# EAGLE schematic Clock2 (EAGLE 7.1.0)
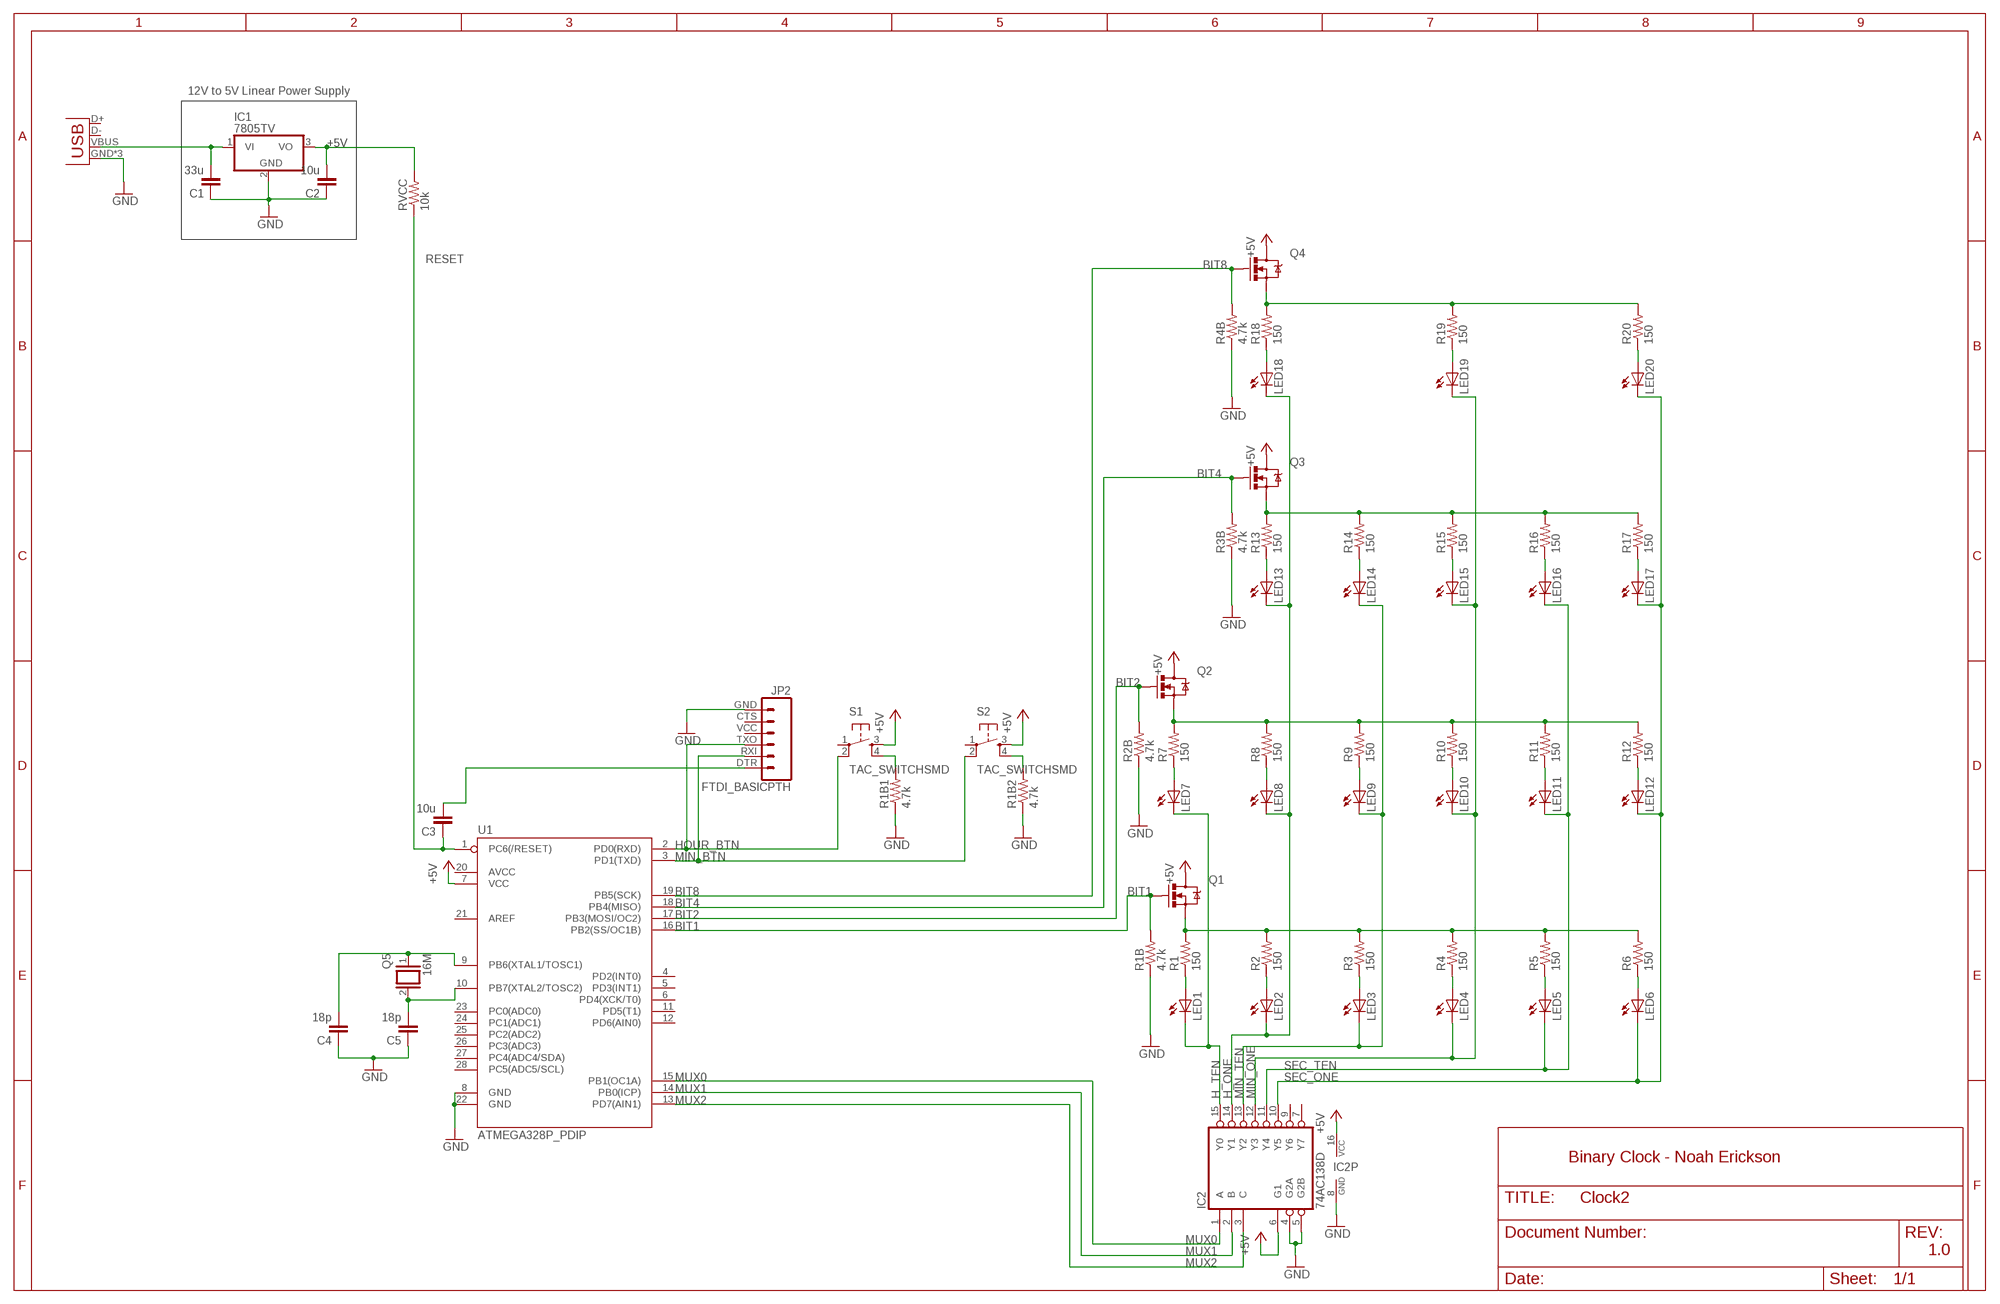
[diagram p0: schematic, sheet 1]

## Parts
C1  33u  C-EUC1206  [C1206]
C2  10u  C-EUC1206  [C1206]
C3  10u  C-EUC1206  [C1206]
C4  18p  C-EUC1206  [C1206]
C5  18p  C-EUC1206  [C1206]
IC1  7805TV  [TO220V]
IC2  74AC138D  [SO16]
JP1  USB-MICROB  [USB-MICROB]
JP2  FTDI_BASICPTH  [FTDI_BASIC]
LED1  LED3MM  [LED3MM]
LED2  LED3MM  [LED3MM]
LED3  LED3MM  [LED3MM]
LED4  LED3MM  [LED3MM]
LED5  LED3MM  [LED3MM]
LED6  LED3MM  [LED3MM]
LED7  LED3MM  [LED3MM]
LED8  LED3MM  [LED3MM]
LED9  LED3MM  [LED3MM]
LED10  LED3MM  [LED3MM]
LED11  LED3MM  [LED3MM]
LED12  LED3MM  [LED3MM]
LED13  LED3MM  [LED3MM]
LED14  LED3MM  [LED3MM]
LED15  LED3MM  [LED3MM]
LED16  LED3MM  [LED3MM]
LED17  LED3MM  [LED3MM]
LED18  LED3MM  [LED3MM]
LED19  LED3MM  [LED3MM]
LED20  LED3MM  [LED3MM]
Q1  MOSFET-NCHANNELBSS138  [SOT23-3]
Q2  MOSFET-NCHANNELBSS138  [SOT23-3]
Q3  MOSFET-NCHANNELBSS138  [SOT23-3]
Q4  MOSFET-NCHANNELBSS138  [SOT23-3]
Q5  16M  XTAL/S  [QS]
R1  150  R-US_R1206  [R1206]
R1B  4.7k  R-US_R1206  [R1206]
R1B1  4.7k  R-US_R1206  [R1206]
R1B2  4.7k  R-US_R1206  [R1206]
R2  150  R-US_R1206  [R1206]
R2B  4.7k  R-US_R1206  [R1206]
R3  150  R-US_R1206  [R1206]
R3B  4.7k  R-US_R1206  [R1206]
R4  150  R-US_R1206  [R1206]
R4B  4.7k  R-US_R1206  [R1206]
R5  150  R-US_R1206  [R1206]
R6  150  R-US_R1206  [R1206]
R7  150  R-US_R1206  [R1206]
R8  150  R-US_R1206  [R1206]
R9  150  R-US_R1206  [R1206]
R10  150  R-US_R1206  [R1206]
R11  150  R-US_R1206  [R1206]
R12  150  R-US_R1206  [R1206]
R13  150  R-US_R1206  [R1206]
R14  150  R-US_R1206  [R1206]
R15  150  R-US_R1206  [R1206]
R16  150  R-US_R1206  [R1206]
R17  150  R-US_R1206  [R1206]
R18  150  R-US_R1206  [R1206]
R19  150  R-US_R1206  [R1206]
R20  150  R-US_R1206  [R1206]
RVCC  10k  R-US_R1206  [R1206]
S1  TAC_SWITCHSMD  [TACTILE-SWITCH-SMD]
S2  TAC_SWITCHSMD  [TACTILE-SWITCH-SMD]
U1  ATMEGA328P_PDIP  [DIL28-3]

## Nets
+5V: C2.2 IC1.3(VO) IC2.6(G1) IC2.16(VCC) Q1.3(D) Q2.3(D) Q3.3(D) Q4.3(D) RVCC.2 S1.3 S2.3 U1.7(VCC)
BIT1: Q1.1(G) R1B.2 U1.16(PB2(SS/OC1B))
BIT2: Q2.1(G) R2B.2 U1.17(PB3(MOSI/OC2))
BIT4: Q3.1(G) R3B.2 U1.18(PB4(MISO))
BIT8: Q4.1(G) R4B.2 U1.19(PB5(SCK))
GND: C1.1 C2.1 C4.1 C5.1 IC1.2(GND) IC2.4(G2A) IC2.5(G2B) IC2.8(GND) JP1.GND JP1.MT1(GND) JP1.MT2(GND) JP2.GND R1B1.1 R1B2.1 R1B.1 R2B.1 R3B.1 R4B.1 U1.8(GND) U1.22(GND)
H_ONE: IC2.14(Y1) LED2.K(C) LED8.K(C) LED13.K(C) LED18.K(C)
H_TEN: IC2.15(Y0) LED1.K(C) LED7.K(C)
HOUR_BTN: JP2.TXO S1.2 U1.2(PD0(RXD))
MIN_BTN: JP2.RXI S2.2 U1.3(PD1(TXD))
MIN_ONE: IC2.12(Y3) LED4.K(C) LED10.K(C) LED15.K(C) LED19.K(C)
MIN_TEN: IC2.13(Y2) LED3.K(C) LED9.K(C) LED14.K(C)
MUX0: IC2.1(A) U1.15(PB1(OC1A))
MUX1: IC2.2(B) U1.14(PB0(ICP))
MUX2: IC2.3(C) U1.13(PD7(AIN1))
N$1: C1.2 IC1.1(VI) JP1.VBUS
N$4: C4.2 Q5.1 U1.9(PB6(XTAL1/TOSC1))
N$5: C5.2 Q5.2 U1.10(PB7(XTAL2/TOSC2))
N$7: Q4.2(S) R18.2 R19.2 R20.2
N$9: LED1.A R1.1
N$10: Q1.2(S) R1.2 R2.2 R3.2 R4.2 R5.2 R6.2
N$11: R1B1.2 S1.4
N$12: R1B2.2 S2.4
N$13: LED2.A R2.1
N$15: C3.2 JP2.DTR
N$17: LED3.A R3.1
N$21: LED7.A R7.1
N$22: Q2.2(S) R7.2 R8.2 R9.2 R10.2 R11.2 R12.2
N$25: LED8.A R8.1
N$28: LED13.A R13.1
N$29: LED9.A R9.1
N$32: Q3.2(S) R13.2 R14.2 R15.2 R16.2 R17.2
N$34: LED4.A R4.1
N$38: LED5.A R5.1
N$40: LED18.A R18.1
N$42: LED6.A R6.1
N$46: LED10.A R10.1
N$50: LED11.A R11.1
N$54: LED12.A R12.1
N$60: LED14.A R14.1
N$64: LED15.A R15.1
N$68: LED19.A R19.1
N$72: LED16.A R16.1
N$76: LED17.A R17.1
N$80: LED20.A R20.1
RESET: C3.1 RVCC.1 U1.1(PC6(/RESET))
SEC_ONE: IC2.10(Y5) LED6.K(C) LED12.K(C) LED17.K(C) LED20.K(C)
SEC_TEN: IC2.11(Y4) LED5.K(C) LED11.K(C) LED16.K(C)
Unconnected: IC2.7(Y7) IC2.9(Y6) JP1.D+ JP1.D- JP2.CTS JP2.VCC S1.1 S2.1 U1.4(PD2(INT0)) U1.5(PD3(INT1)) U1.6(PD4(XCK/T0)) U1.11(PD5(T1)) U1.12(PD6(AIN0)) U1.20(AVCC) U1.21(AREF) U1.23(PC0(ADC0)) U1.24(PC1(ADC1)) U1.25(PC2(ADC2)) U1.26(PC3(ADC3)) U1.27(PC4(ADC4/SDA)) U1.28(PC5(ADC5/SCL))

## Notes on the sheet
- 12V to 5V Linear Power Supply
- Binary Clock - Noah Erickson
- 1.0

## Library data of the parts
C1-C5 = rcl:C-EU: CAPACITOR, European symbol
IC1 = linear:78*: Positive VOLTAGE REGULATOR Source: http://cache.national.com/ds/LM/LM78L05.pdf http://www.fairchildsemi.com/ds/LM/LM7805.pdf
IC2 = 74xx-eu:74*138: 3-line to 8-line DECODER/DEMULTIPLEXER
JP1 = SparkFun-Connectors:USB: USB Connectors USB-B-PTH is fully proven SKU : PRT-00139/CONN-08278 USB-miniB is fully proven SKU : PRT-00587 USB-A-PCB is untested. USB-A-H is throughly reviewed, but untested. Spark Fun Electronics SKU : PRT-00437 USB-B-SMT is throughly reviewed, but untested. Needs silkscreen touching up. USB-A-S has not been used/tested USB-MB-H has not been used/tested USB-MICROB has been used. CONN-09505; PROD_ID: CONN-09505
JP2 = SparkFun-Connectors:FTDI_BASIC: FTDI Basic header with labels
LED1-LED20 = led:LED: LED OSRAM: - CHIPLED LG R971, LG N971, LY N971, LG Q971, LY Q971, LO R971, LY R971 LH N974, LH R974 LS Q976, LO Q976, LY Q976 LO Q996 - Hyper CHIPLED LW Q18S LB Q993, LB Q99A, LB R99A - SideLED LS A670, LO A670, LY A670, LG A670, LP A670 LB A673, LV A673, LT A673, LW A673 LH A674 LY A675 LS A676, LA A676, LO A676, LY A676, LW A676 LS A679, LY A679, LG A679 - Hyper Micro SIDELED® LS Y876, LA Y876, LO Y876, LY Y876 LT Y87S - SmartLED LW L88C, LW L88S LB L89C, LB L89S, LG L890 LS L89K, LO L89K, LY L89K LS L896, LA L896, LO L896, LY L896 - TOPLED LS T670, LO T670, LY T670, LG T670, LP T670 LSG T670, LSP T670, LSY T670, LOP T670, LYG T670 LG T671, LOG T671, LSG T671 LB T673, LV T673, LT T673, LW T673 LH T674 LS T676, LA T676, LO T676, LY T676, LB T676, LH T676, LSB T676, LW T676 LB T67C, LV T67C, LT T67C, LS T67K, LO T67K, LY T67K, LW E67C LS E67B, LA E67B, LO E67B, LY E67B, LB E67C, LV E67C, LT E67C LW T67C LS T679, LY T679, LG T679 LS T770, LO T770, LY T770, LG T770, LP T770 LB T773, LV T773, LT T773, LW T773 LH T774 LS E675, LA E675, LY E675, LS T675 LS T776, LA T776, LO T776, LY T776, LB T776 LHGB T686 LT T68C, LB T68C - Hyper Mini TOPLED® LB M676 - Mini TOPLED Santana® LG M470 LS M47K, LO M47K, LY M47K Source: http://www.osram.convergy.de LUXEON: - LUMILED® LXK2-PW12-R00, LXK2-PW12-S00, LXK2-PW14-U00, LXK2-PW14-V00 LXK2-PM12-R00, LXK2-PM12-S00, LXK2-PM14-U00 LXK2-PE12-Q00, LXK2-PE12-R00, LXK2-PE12-S00, LXK2-PE14-T00, LXK2-PE14-U00 LXK2-PB12-K00, LXK2-PB12-L00, LXK2-PB12-M00, LXK2-PB14-N00, LXK2-PB14-P00, LXK2-PB14-Q00 LXK2-PR12-L00, LXK2-PR12-M00, LXK2-PR14-Q00, LXK2-PR14-R00 LXK2-PD12-Q00, LXK2-PD12-R00, LXK2-PD12-S00 LXK2-PH12-R00, LXK2-PH12-S00 LXK2-PL12-P00, LXK2-PL12-Q00, LXK2-PL12-R00 Source: www.luxeon.com KINGBRIGHT: KA-3528ASYC Source: www.kingbright.com
Q1-Q4 = SparkFun-DiscreteSemi:MOSFET-NCHANNEL: Common NMOSFET Parts MFG P/N Store ID Prod ID FDD8780 TRANS-09984 SI7820DN TRANS-11055 FDS6630A IC-08089 2N7002PW TRANS-11151 FQP30N06L COM-10213 TRANS-10060 BSS123LT1G TRANS-08345 BSS138 TRANS-00830 BS170 2N7000; PROD_ID: TRANS-00830
Q5 = special:XTAL/S: CRYSTAL
R1 R1B R1B1 R1B2 R2 R2B R3 R3B R4 R4B R5-R20 RVCC = rcl:R-US_: RESISTOR, American symbol
S1 S2 = SparkFun-Electromechanical:TAC_SWITCH: Momentary Switch Button commonly used for reset or general input. Spark Fun Electronics SKU : COM-00097 SMT- SWCH-08247; PROD_ID: SWCH-08247
U1 = SparkFun-DigitalIC:ATMEGA328P_PDIP: uC used in the Arduino 32kb flash, 1k EEPROM, 2k SRAM This is the through-hole version of this chip.